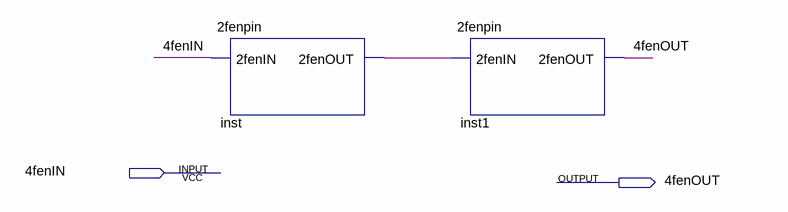
[diagram p0: schematic sheet]
// Quartus schematic 4fenpin.bdf as structural Verilog: 2 symbols, 2 pins
module \4fenpin  (
  input  \4fenIN ,
  output \4fenOUT 
);

  wire inst_2fenout;

  \2fenpin  inst (.\2fenIN (\4fenIN ), .\2fenOUT (inst_2fenout));
  \2fenpin  inst1 (.\2fenIN (inst_2fenout), .\2fenOUT (\4fenOUT ));
endmodule
